# EAGLE design TSOC_GROVEY_GPIO (EAGLE 6.6.0)
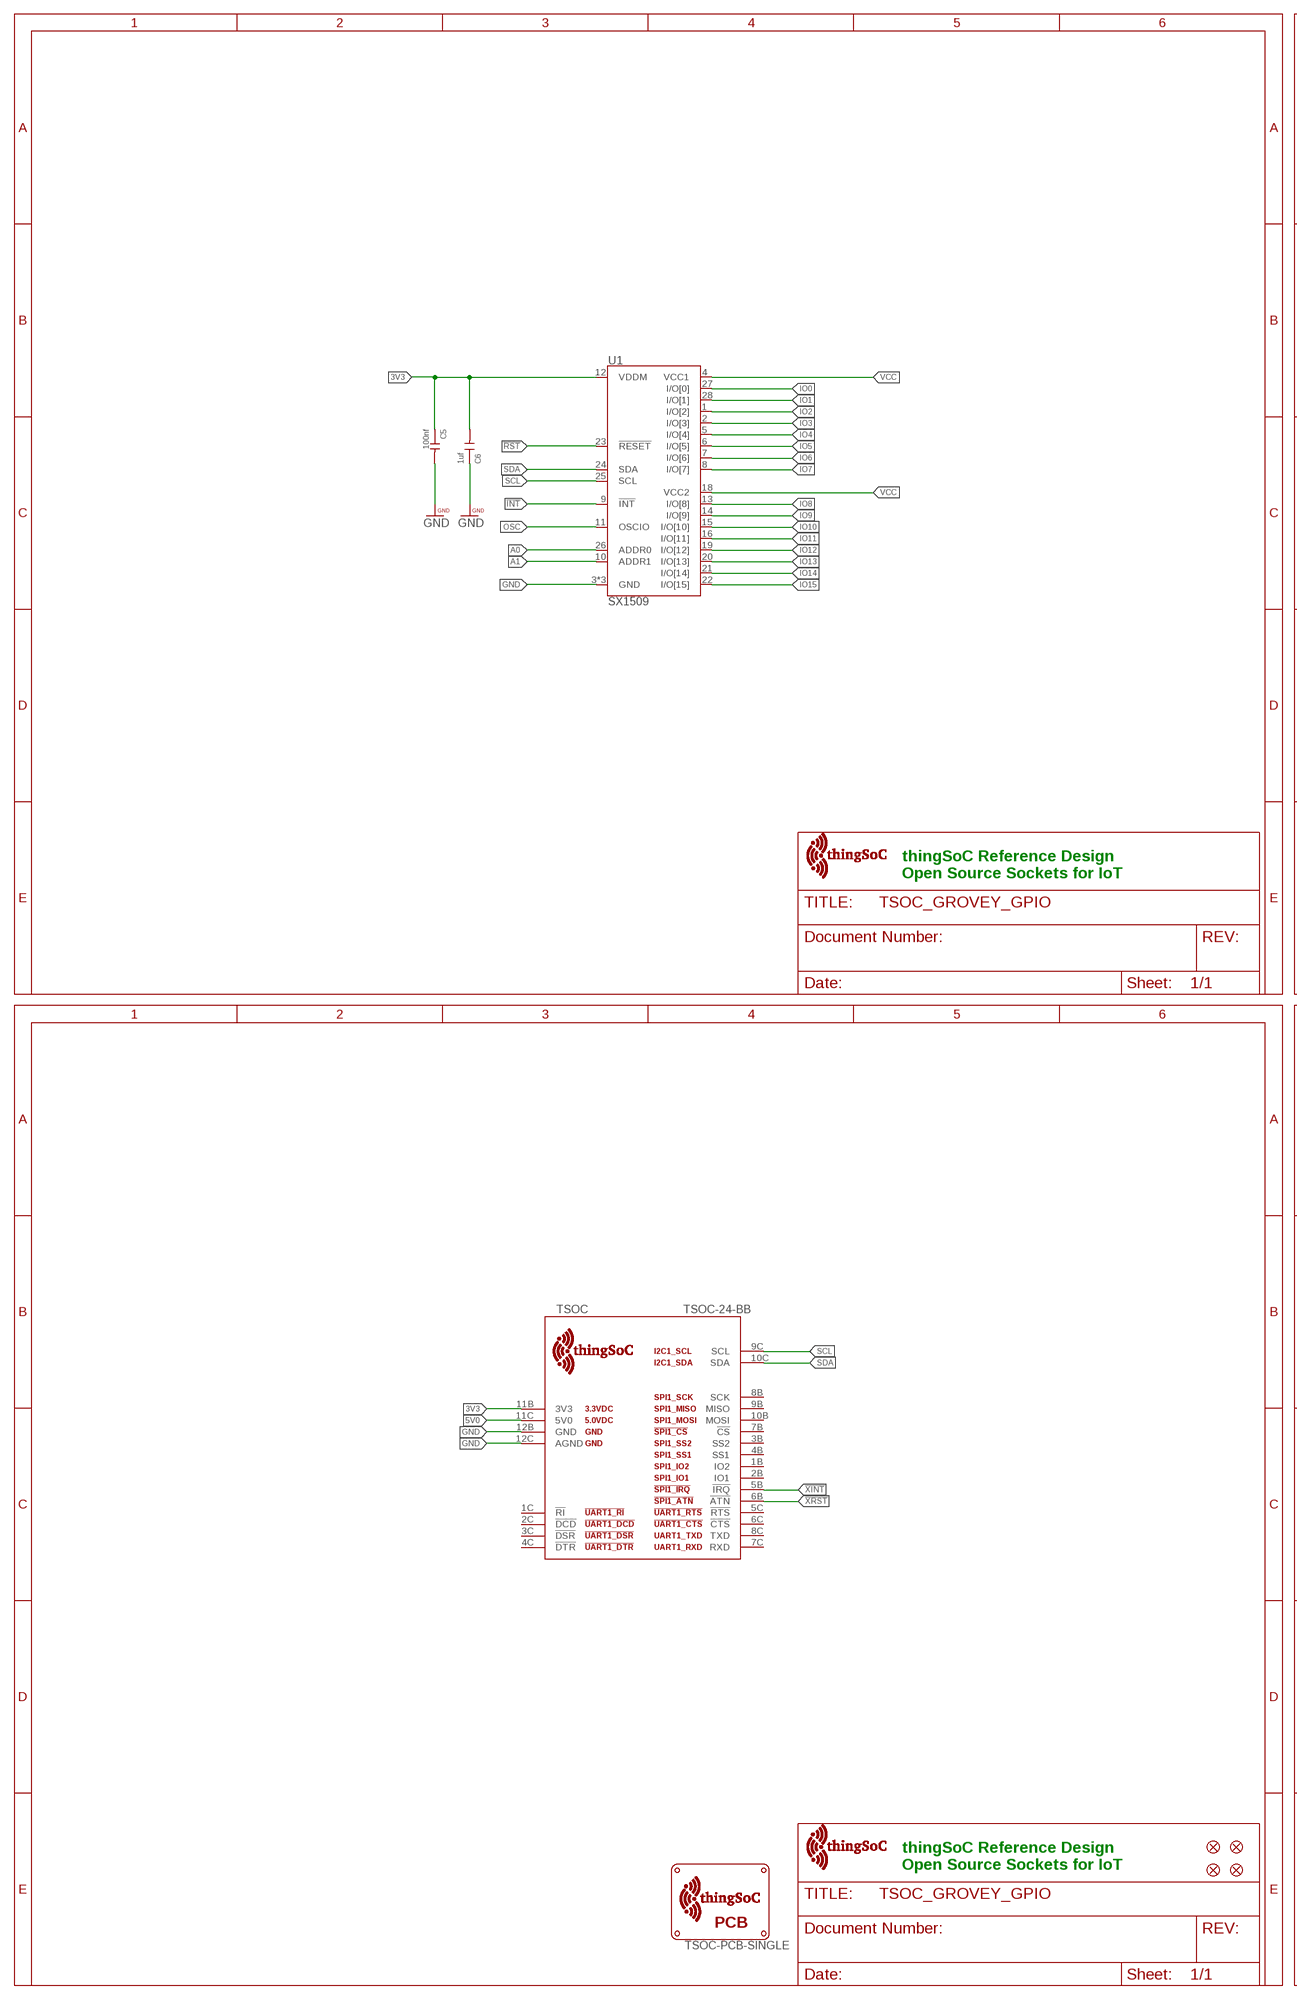
[diagram p0: schematic, sheet 1, part 1 of 2]
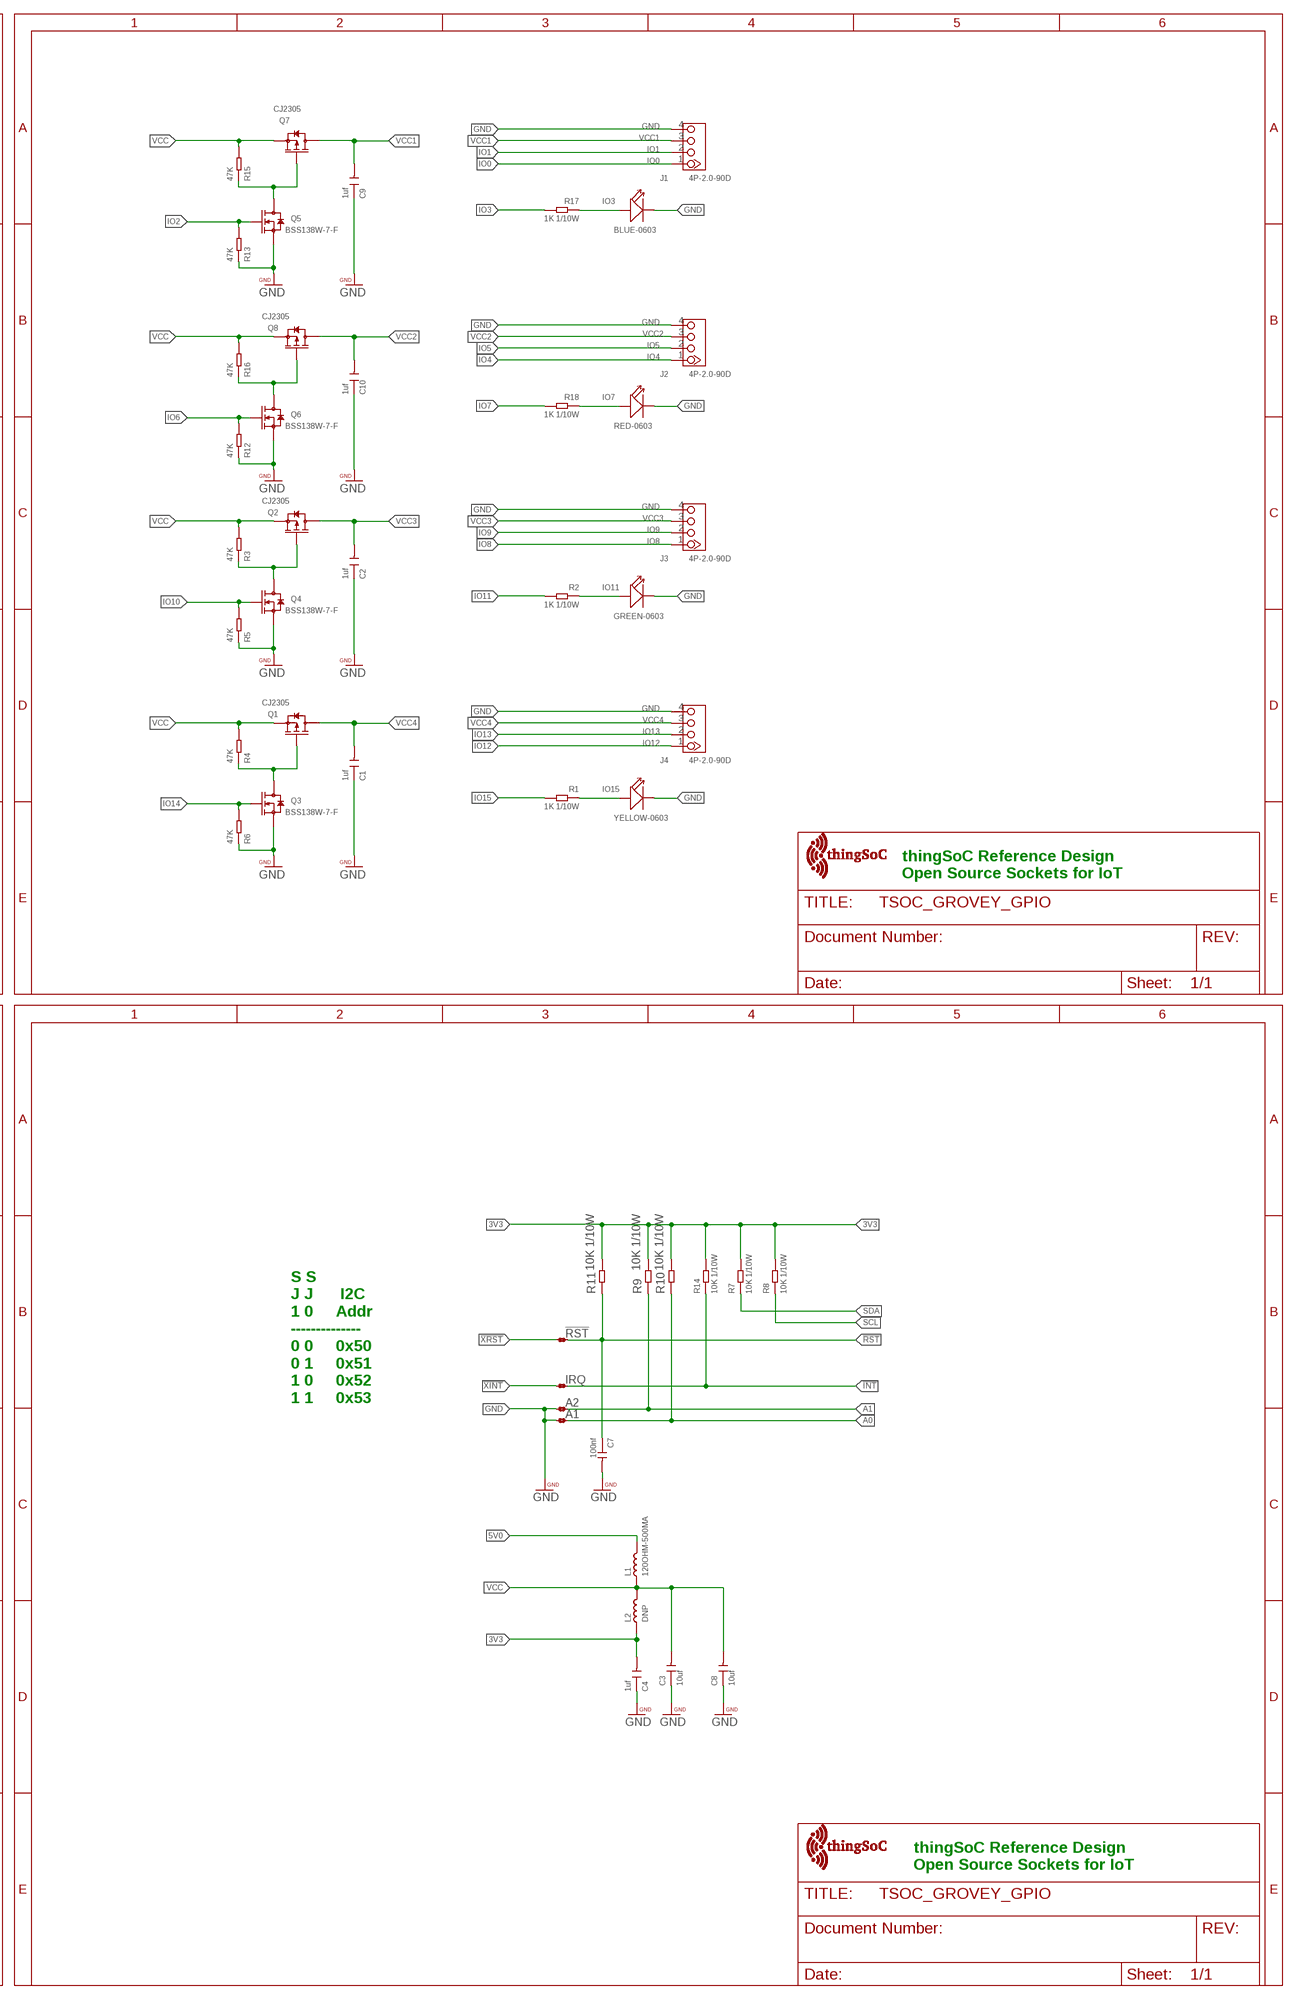
[diagram p1: schematic, sheet 1, part 2 of 2]

## Parts
!RST  NO  JMP-2-NO  [JMP-2-NO]
$$U$1  TSOC-LOGO-SMALL  [TSOC-LOGO-SML]
$$U$2  TSOC-LOGO-SMALL  [TSOC-LOGO-SML]
A1  NO  JMP-2-NO  [JMP-2-NO]
A2  NO  JMP-2-NO  [JMP-2-NO]
C1  1uf  CERAMIC-1UF-25V-10%-X7R(0603)  [C0603]
C2  1uf  CERAMIC-1UF-25V-10%-X7R(0603)  [C0603]
C3  10uf  CERAMIC-10UF-25V-10%-X5R(1206)  [C1206]
C4  1uf  CERAMIC-1UF-25V-10%-X7R(0603)  [C0603]
C5  100nf  CERAMIC-100NF-50V-10%-X7R(0603)  [C0603]
C6  1uf  CERAMIC-1UF-25V-10%-X7R(0603)  [C0603]
C7  100nf  CERAMIC-100NF-50V-10%-X7R(0603)  [C0603]
C8  10uf  CERAMIC-10UF-25V-10%-X5R(1206)  [C1206]
C9  1uf  CERAMIC-1UF-25V-10%-X7R(0603)  [C0603]
C10  1uf  CERAMIC-1UF-25V-10%-X7R(0603)  [C0603]
FID1  FIDUCIALUFIDUCIAL  [MICRO-FIDUCIAL]
FID2  FIDUCIALUFIDUCIAL  [MICRO-FIDUCIAL]
FID3  FIDUCIALUFIDUCIAL  [MICRO-FIDUCIAL]
FID4  FIDUCIALUFIDUCIAL  [MICRO-FIDUCIAL]
IO3  BLUE-0603  SMD-LED-CLEAR-BLUE(0603)  [LED-0603]
IO7  RED-0603  LED-SMD-RED-DIFFUSED(0603)  [LED-0603]
IO11  GREEN-0603  SMD-LED-CLEAR-GREEN(0603)  [LED-0603]
IO15  YELLOW-0603  SMD-LED-CLEAR-YELLOW(0603)  [LED-0603]
IRQ  NO  JMP-2-NO  [JMP-2-NO]
J1  4P-2.0-90D  GROVE-CONNECTOR-DIP-90D(4P-2.0)  [HW4-2.0-90D]
J2  4P-2.0-90D  GROVE-CONNECTOR-DIP-90D(4P-2.0)  [HW4-2.0-90D]
J3  4P-2.0-90D  GROVE-CONNECTOR-DIP-90D(4P-2.0)  [HW4-2.0-90D]
J4  4P-2.0-90D  GROVE-CONNECTOR-DIP-90D(4P-2.0)  [HW4-2.0-90D]
L1  120OHM-500MA  SMD-FERRITE-CHIP-120-OHM-500MA(0603)  [L0603]
L2  DNP  SMD-FERRITE-CHIP-120-OHM-500MA(0603)  [L0603]
Q1  CJ2305  SMD-MOSFET-P-CH-8V-4.1A-CJ2305(SOT-23)  [SOT-23]
Q2  CJ2305  SMD-MOSFET-P-CH-8V-4.1A-CJ2305(SOT-23)  [SOT-23]
Q3  BSS138W-7-F  SMD-MOSFET-N-CH-50V-200MA-BSS138W-7-F(SOT-23)  [SOT-23]
Q4  BSS138W-7-F  SMD-MOSFET-N-CH-50V-200MA-BSS138W-7-F(SOT-23)  [SOT-23]
Q5  BSS138W-7-F  SMD-MOSFET-N-CH-50V-200MA-BSS138W-7-F(SOT-23)  [SOT-23]
Q6  BSS138W-7-F  SMD-MOSFET-N-CH-50V-200MA-BSS138W-7-F(SOT-23)  [SOT-23]
Q7  CJ2305  SMD-MOSFET-P-CH-8V-4.1A-CJ2305(SOT-23)  [SOT-23]
Q8  CJ2305  SMD-MOSFET-P-CH-8V-4.1A-CJ2305(SOT-23)  [SOT-23]
R1  1K 1/10W  SMD-RES-1K-5%-1/10W(0603)  [R0603]
R2  1K 1/10W  SMD-RES-1K-5%-1/10W(0603)  [R0603]
R3  47K  SMD-RES-47K-5%-1/10W(0603)  [R0603]
R4  47K  SMD-RES-47K-5%-1/10W(0603)  [R0603]
R5  47K  SMD-RES-47K-5%-1/10W(0603)  [R0603]
R6  47K  SMD-RES-47K-5%-1/10W(0603)  [R0603]
R7  10K 1/10W  SMD-RES-10K-5%-1/10W(0603)  [R0603]
R8  10K 1/10W  SMD-RES-10K-5%-1/10W(0603)  [R0603]
R9  10K 1/10W  SMD-RES-10K-5%-1/10W(0603)  [R0603]
R10  10K 1/10W  SMD-RES-10K-5%-1/10W(0603)  [R0603]
R11  10K 1/10W  SMD-RES-10K-5%-1/10W(0603)  [R0603]
R12  47K  SMD-RES-47K-5%-1/10W(0603)  [R0603]
R13  47K  SMD-RES-47K-5%-1/10W(0603)  [R0603]
R14  10K 1/10W  SMD-RES-10K-5%-1/10W(0603)  [R0603]
R15  47K  SMD-RES-47K-5%-1/10W(0603)  [R0603]
R16  47K  SMD-RES-47K-5%-1/10W(0603)  [R0603]
R17  1K 1/10W  SMD-RES-1K-5%-1/10W(0603)  [R0603]
R18  1K 1/10W  SMD-RES-1K-5%-1/10W(0603)  [R0603]
TSOC  TSOC-24-BB  [TSOC-BB-S24]
U1  SX1509  [QFN-28]
U$3  TSOC-PCB-SINGLE  [TSOC-BB-BRD-DIM]
U$101  TSOC-LOGO-LRG  [TSOC-LOGO-LRG]
U$102  TSOC-LOGO-SMALL  [TSOC-LOGO-SML]

## Nets
3V3: C4.2 C5.1 C6.2 L2.1 R7.2 R8.2 R9.2 R10.2 R11.2 R14.2 TSOC.11B(3V3) U1.12(VDDM)
5V0: L1.2 TSOC.11C(5V0)
!INT: IRQ.2 R14.1 U1.9(!INT)
!RST: !RST.1 C7.1 R11.1 U1.23(!RESET)
!XINT: IRQ.1 TSOC.5B(!IRQ)
!XRST: !RST.2 TSOC.6B(!ATN)
A0: A1.2 R10.1 U1.26(ADDR0)
A1: A2.2 R9.1 U1.10(ADDR1)
GND: A1.1 A2.1 C1.1 C2.1 C3.1 C4.1 C5.2 C6.1 C7.2 C8.1 C9.1 C10.1 IO3.- IO7.- IO11.- IO15.- J1.4 J2.4 J3.4 J4.4 Q3.2(S) Q4.2(S) Q5.2(S) Q6.2(S) R5.1 R6.1 R12.1 R13.1 TSOC.12B(GND) TSOC.12C(AGND) U1.3(GND) U1.17(GND) U1.29(GND)
IO0: J1.1 U1.27(I/O[0])
IO1: J1.2 U1.28(I/O[1])
IO2: Q5.1(G) R13.2 U1.1(I/O[2])
IO3: R17.2 U1.2(I/O[3])
IO4: J2.1 U1.5(I/O[4])
IO5: J2.2 U1.6(I/O[5])
IO6: Q6.1(G) R12.2 U1.7(I/O[6])
IO7: R18.2 U1.8(I/O[7])
IO8: J3.1 U1.13(I/O[8])
IO9: J3.2 U1.14(I/O[9])
IO10: Q4.1(G) R5.2 U1.15(I/O[10])
IO11: R2.2 U1.16(I/O[11])
IO12: J4.1 U1.19(I/O[12])
IO13: J4.2 U1.20(I/O[13])
IO14: Q3.1(G) R6.2 U1.21(I/O[14])
IO15: R1.2 U1.22(I/O[15])
LED1: IO11.+ R2.1
LED2: IO7.+ R18.1
LED3: IO3.+ R17.1
LED4: IO15.+ R1.1
N$1: Q2.1(G) Q4.3(D) R3.1
N$2: Q1.1(G) Q3.3(D) R4.1
N$3: Q5.3(D) Q7.1(G) R15.1
N$4: Q6.3(D) Q8.1(G) R16.1
OSC: U1.11(OSCIO)
SCL: R8.1 TSOC.9C(SCL) U1.25(SCL)
SDA: R7.1 TSOC.10C(SDA) U1.24(SDA)
VCC: C3.2 C8.2 L1.1 L2.2 Q1.2(S) Q2.2(S) Q7.2(S) Q8.2(S) R3.2 R4.2 R15.2 R16.2 U1.4(VCC1) U1.18(VCC2)
VCC1: C9.2 J1.3 Q7.3(D)
VCC2: C10.2 J2.3 Q8.3(D)
VCC3: C2.2 J3.3 Q2.3(D)
VCC4: C1.2 J4.3 Q1.3(D)
Unconnected: TSOC.1B(IO2) TSOC.1C(!RI) TSOC.2B(IO1) TSOC.2C(!DCD) TSOC.3B(SS2) TSOC.3C(!DSR) TSOC.4B(SS1) TSOC.4C(!DTR) TSOC.5C(!RTS) TSOC.6C(!CTS) TSOC.7B(!CS) TSOC.7C(RXD) TSOC.8B(SCK) TSOC.8C(TXD) TSOC.9B(MISO) TSOC.10B(MOSI)

## Notes on the sheet
- thingSoC Reference Design
  Open Source Sockets for IoT
- thingSoC Reference Design
  Open Source Sockets for IoT
- S S
  J J      I2C
  1 0     Addr
  --------------
  0 0     0x50
  0 1     0x51
  1 0     0x52
  1 1     0x53
- thingSoC Reference Design
  Open Source Sockets for IoT
- thingSoC Reference Design
  Open Source Sockets for IoT

## Library data of the parts
!RST A1 A2 IRQ = scratch-ProtoPads:JMP-2-NO: Basic Jumper - Normally Open Positions 1 and 2 are normally NOT connected. PatternAgents ProtoPads Library Schematic and PCB layout libraries for design patterns by PatternAgents. For the CADSoft Eagle CAD program : http://www.cadsoftusa.com/download-eagle/ Source LBR : http://www.patternagents.com Github : https://github.com/PatternAgents License : http://creativecommons.org/licenses/by-sa/4.0/ (Creative Commons 4.0) THIS SOFTWARE IS PROVIDED BY THE CONTRIBUTORS "AS IS" AND WITHOUT ANY EXPRESS OR IMPLIED WARRANTIES, INCLUDING, BUT NOT LIMITED TO, THE IMPLIED WARRANTIES OF MERCHANTABILITY AND FITNESS FOR A PARTICULAR PURPOSE ARE DISCLAIMED. IN NO EVENT SHALL THE COPYRIGHT OWNER OR CONTRIBUTORS BE LIABLE FOR ANY DIRECT, INDIRECT, INCIDENTAL, SPECIAL, EXEMPLARY, OR CONSEQUENTIAL DAMAGES (INCLUDING, BUT NOT LIMITED TO, PROCUREMENT OF SUBSTITUTE GOODS OR SERVICES; LOSS OF USE, DATA, OR PROFITS; OR BUSINESS INTERRUPTION) HOWEVER CAUSED AND ON ANY THEORY OF LIABILITY, WHETHER IN CONTRACT, STRICT LIABILITY, OR TORT (INCLUDING NEGLIGENCE OR OTHERWISE) ARISING IN ANY WAY OUT OF THE USE OF THIS SOFTWARE, EVEN IF ADVISED OF THE POSSIBILITY OF SUCH DAMAGE.; BOM: EXCLUDE
$$U$1 $$U$2 U$101 U$102 = thingSoC:TSOC-LOGO: thingSoC Logo Source LBR : http://www.thingsoc.com Github : https://github.com/thingsoc License : http://creativecommons.org/licenses/by-sa/4.0/ (Creative Commons 4.0) THIS SOFTWARE IS PROVIDED BY THE CONTRIBUTORS "AS IS" AND WITHOUT ANY EXPRESS OR IMPLIED WARRANTIES, INCLUDING, BUT NOT LIMITED TO, THE IMPLIED WARRANTIES OF MERCHANTABILITY AND FITNESS FOR A PARTICULAR PURPOSE ARE DISCLAIMED. IN NO EVENT SHALL THE COPYRIGHT OWNER OR CONTRIBUTORS BE LIABLE FOR ANY DIRECT, INDIRECT, INCIDENTAL, SPECIAL, EXEMPLARY, OR CONSEQUENTIAL DAMAGES (INCLUDING, BUT NOT LIMITED TO, PROCUREMENT OF SUBSTITUTE GOODS OR SERVICES; LOSS OF USE, DATA, OR PROFITS; OR BUSINESS INTERRUPTION) HOWEVER CAUSED AND ON ANY THEORY OF LIABILITY, WHETHER IN CONTRACT, STRICT LIABILITY, OR TORT (INCLUDING NEGLIGENCE OR OTHERWISE) ARISING IN ANY WAY OUT OF THE USE OF THIS SOFTWARE, EVEN IF ADVISED OF THE POSSIBILITY OF SUCH DAMAGE.
C1 C2 C4 C6 C9 C10 = Seeed-Capacitor-2016:CERAMIC-1UF-25V-10%-X7R(0603): 302010139; MPN: CC0603KRX7R8BB105
C3 C8 = Seeed-Capacitor-2016:CERAMIC-10UF-25V-10%-X5R(1206): 302010181; MPN: CC1206KKX5R8BB106
C5 C7 = Seeed-Capacitor-2016:CERAMIC-100NF-50V-10%-X7R(0603): 302010138; MPN: CC0603KRX7R9BB104
FID1-FID4 = TSOC-ESP8266-BASE:FIDUCIAL: Fiducial Alignment Points Various fiducial points for machine vision alignment.
IO3 = Seeed-LED-2016:SMD-LED-CLEAR-BLUE(0603): 304090045; MPN: 19-217-BHC-ZL1M2RY-3T
IO7 = Seeed-LED-2016:LED-SMD-RED-DIFFUSED(0603): 304090042; MPN: 19-217-R6C-AL1M2VY-3T
IO11 = Seeed-LED-2016:SMD-LED-CLEAR-GREEN(0603): 304090043; MPN: 19-217-G7C-AN1P2-3T
IO15 = Seeed-LED-2016:SMD-LED-CLEAR-YELLOW(0603): 304090044; MPN: 19-217-Y5C-AM1N1VY-3T
J1-J4 = Seeed-Connector -2016:GROVE-CONNECTOR-DIP-90D(4P-2.0): 320110034
L1 = Seeed-Inductor-2016:SMD-FERRITE-CHIP-120-OHM-500MA(0603): 303030001; MPN: BLM18AG121SN1D
L2 = Seeed-Inductor-2016:SMD-FERRITE-CHIP-120-OHM-500MA(0603): 303030001; MPN: BLM18AG121SN1D; VALUE: 120OHM-500MA
Q1 Q2 Q7 Q8 = Seeed-Transistor-2016:SMD-MOSFET-P-CH-8V-4.1A-CJ2305(SOT-23): 305030014; MPN: CJ2305
Q3-Q6 = Seeed-Transistor-2016:SMD-MOSFET-N-CH-50V-200MA-BSS138W-7-F(SOT-23): 305030000; MPN: BSS138W-7-F
R1 R2 R17 R18 = Seeed-Resistor-2016:SMD-RES-1K-5%-1/10W(0603): 301010291; MPN: RC0603JR-071KL
R3-R6 R12 R13 R15 R16 = Seeed-Resistor-2016:SMD-RES-47K-5%-1/10W(0603): 301010084; MPN: RC0603JR-0747KL
R7-R11 R14 = Seeed-Resistor-2016:SMD-RES-10K-5%-1/10W(0603): 301010293; MPN: RC0603JR-0710KL
TSOC = thingSoC:TSOC-24: thingSoC Twenty-Four(24) Pin Socket Source LBR : http://www.thingsoc.com Github : https://github.com/thingsoc License : http://creativecommons.org/licenses/by-sa/4.0/ (Creative Commons 4.0) THIS SOFTWARE IS PROVIDED BY THE CONTRIBUTORS "AS IS" AND WITHOUT ANY EXPRESS OR IMPLIED WARRANTIES, INCLUDING, BUT NOT LIMITED TO, THE IMPLIED WARRANTIES OF MERCHANTABILITY AND FITNESS FOR A PARTICULAR PURPOSE ARE DISCLAIMED. IN NO EVENT SHALL THE COPYRIGHT OWNER OR CONTRIBUTORS BE LIABLE FOR ANY DIRECT, INDIRECT, INCIDENTAL, SPECIAL, EXEMPLARY, OR CONSEQUENTIAL DAMAGES (INCLUDING, BUT NOT LIMITED TO, PROCUREMENT OF SUBSTITUTE GOODS OR SERVICES; LOSS OF USE, DATA, OR PROFITS; OR BUSINESS INTERRUPTION) HOWEVER CAUSED AND ON ANY THEORY OF LIABILITY, WHETHER IN CONTRACT, STRICT LIABILITY, OR TORT (INCLUDING NEGLIGENCE OR OTHERWISE) ARISING IN ANY WAY OUT OF THE USE OF THIS SOFTWARE, EVEN IF ADVISED OF THE POSSIBILITY OF SUCH DAMAGE.
U1 = SparkFun-DigitalIC:SX1509: Semtech SX1509 The SX1509 is a complete ultra low voltage 1.2V to 3.6V General Purpose parallel Input/Output (GPIO) expanders ideal for low power handheld battery powered equipment. This version comes in a 16-channel configuration and allows easy serial expansion of I/O through a standard 400kHz I2C interface. GPIO devices can provide additional control and monitoring when the microcontroller or chipset has insufficient I/O ports, or in systems where serial communication and control from a remote location is advantageous.; PROD_ID: IC-11311
U$3 = thingSoC:TSOC-PCB: thingSoC PCB Outlines Boards Outlines for Standard Sizes (in the DImension Layer) (Registration marks in the tDocu layer - make sure to turn on tDocu/bDocu) Source LBR : http://www.thingsoc.com Github : https://github.com/thingsoc License : http://creativecommons.org/licenses/by-sa/4.0/ (Creative Commons 4.0) THIS SOFTWARE IS PROVIDED BY THE CONTRIBUTORS "AS IS" AND WITHOUT ANY EXPRESS OR IMPLIED WARRANTIES, INCLUDING, BUT NOT LIMITED TO, THE IMPLIED WARRANTIES OF MERCHANTABILITY AND FITNESS FOR A PARTICULAR PURPOSE ARE DISCLAIMED. IN NO EVENT SHALL THE COPYRIGHT OWNER OR CONTRIBUTORS BE LIABLE FOR ANY DIRECT, INDIRECT, INCIDENTAL, SPECIAL, EXEMPLARY, OR CONSEQUENTIAL DAMAGES (INCLUDING, BUT NOT LIMITED TO, PROCUREMENT OF SUBSTITUTE GOODS OR SERVICES; LOSS OF USE, DATA, OR PROFITS; OR BUSINESS INTERRUPTION) HOWEVER CAUSED AND ON ANY THEORY OF LIABILITY, WHETHER IN CONTRACT, STRICT LIABILITY, OR TORT (INCLUDING NEGLIGENCE OR OTHERWISE) ARISING IN ANY WAY OUT OF THE USE OF THIS SOFTWARE, EVEN IF ADVISED OF THE POSSIBILITY OF SUCH DAMAGE.

## Board
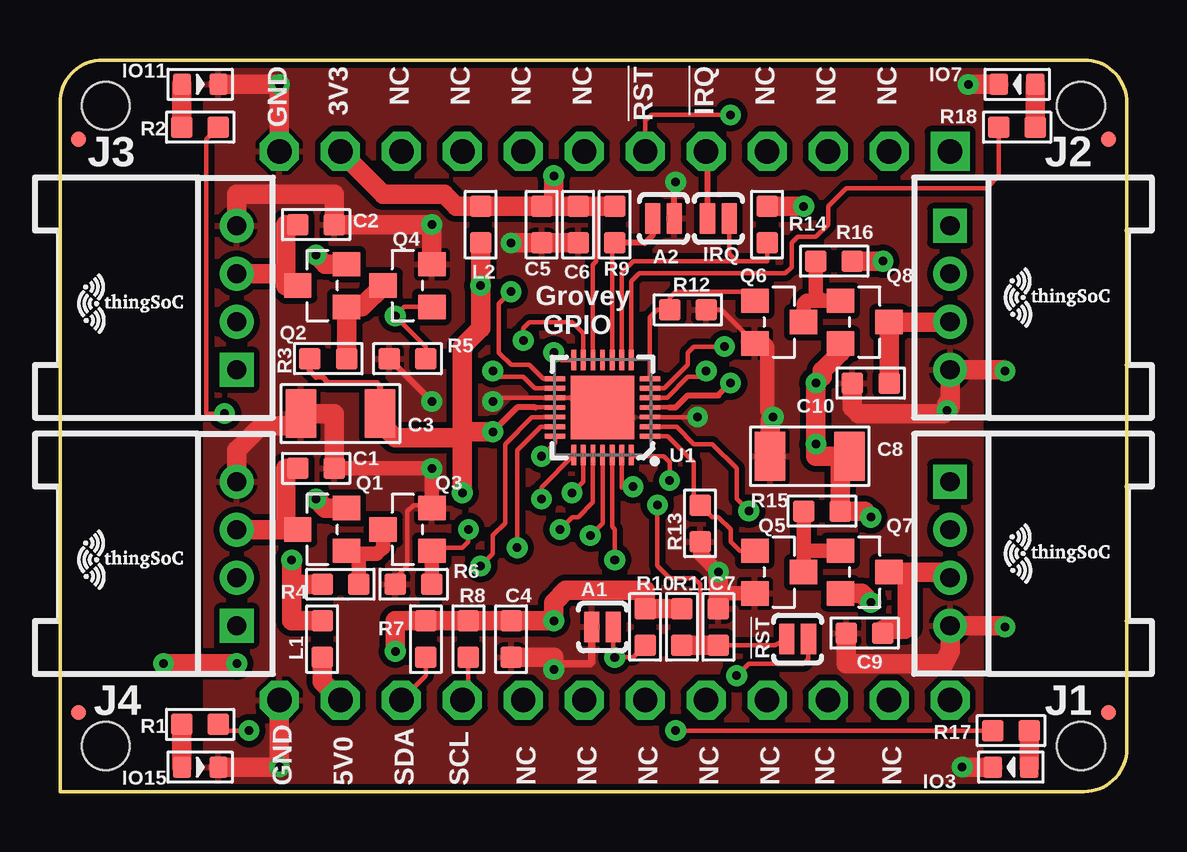
[diagram p2: board, top side]
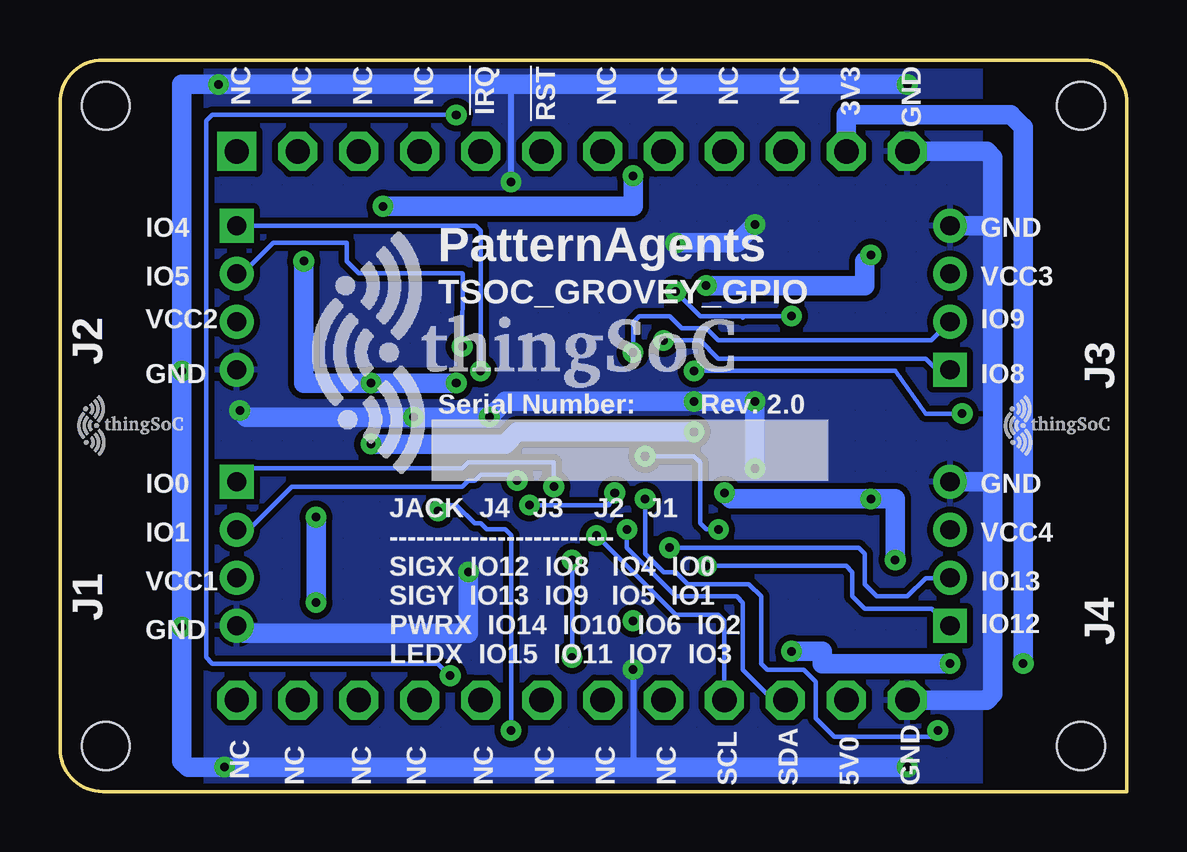
[diagram p3: board, bottom side, seen from below]

Size 44.45 x 30.48 mm. Coordinates in mm from the lower left corner, seen from the top.
Copper layers (1*16): Top 0.035mm / dielectric 1.5mm / Bottom 0.035mm
Design rules "PatternAgents_7mil": minimum track width 7mil, minimum drill 14mil, track to track 7mil, track to pad 7mil, pad to pad 7mil, via to via 7mil, smd to smd 7mil, copper to edge 7mil, drill to drill 7mil, minimum pad ring 12mil, minimum via ring 10mil, stop-mask expansion 4mil, vias tented up to drill 25mil, thermal gap 7mil

### Footprints (pad centres in the part's own frame; a part is rotated, then mirrored left to right if it is on the bottom)
JMP-2-NO = smd 0.635 x 1.27: 1 -0.45,0; 2 0.45,0
C0603 = smd 0.889 x 0.889: 1 0,0.762; 2 0,-0.762
C1206 = smd 1.27 x 2.032: 1 -1.651,0; 2 1.651,0
MICRO-FIDUCIAL = smd 0.635 x 0.635: 1 0,0
LED-0603 = smd 0.762 x 0.889: + -0.762,0; - 0.762,0
HW4-2.0-90D = drill 0.8 pad 1.27 square: 1 -3,0 | drill 0.8 pad 1.27: 2 -1,0; 3 1,0; 4 3,0
L0603 = smd 0.889 x 0.889: 1 -0.762,0; 2 0.762,0
SOT-23 = smd 1.016 x 1.143: 1 -0.889,-1.016; 2 0.889,-1.016; 3 0,1.016
R0603 = smd 0.889 x 0.889: 1 0,0.762; 2 0,-0.762
TSOC-BB-S24 = drill 1.016 square: 1B -11.43,11.43 | drill 1.016 octagon: 1C 11.43,11.43; 2B -11.43,8.89; 2C 11.43,8.89; 3B -11.43,6.35; 3C 11.43,6.35; 4B -11.43,3.81; 4C 11.43,3.81; 5B -11.43,1.27; 5C 11.43,1.27; 6B -11.43,-1.27; 6C 11.43,-1.27; 7B -11.43,-3.81; 7C 11.43,-3.81; 8B -11.43,-6.35; 8C 11.43,-6.35; 9B -11.43,-8.89; 9C 11.43,-8.89; 10B -11.43,-11.43; 10C 11.43,-11.43; 11B -11.43,-13.97; 11C 11.43,-13.97; 12B -11.43,-16.51; 12C 11.43,-16.51
QFN-28 = smd 0.85 x 0.2: 1 -1.975,1.2; 2 -1.975,0.8; 3 -1.975,0.4; 4 -1.975,0; 5 -1.975,-0.4; 6 -1.975,-0.8; 7 -1.975,-1.2; 15 1.975,-1.2; 16 1.975,-0.8; 17 1.975,-0.4; 18 1.975,0; 19 1.975,0.4; 20 1.975,0.8; 21 1.975,1.2 | smd 0.2 x 0.85: 8 -1.2,-1.975; 9 -0.8,-1.975; 10 -0.4,-1.975; 11 0,-1.975; 12 0.4,-1.975; 13 0.8,-1.975; 14 1.2,-1.975; 22 1.2,1.975; 23 0.8,1.975; 24 0.4,1.975; 25 0,1.975; 26 -0.4,1.975; 27 -0.8,1.975; 28 -1.2,1.975 | smd 2.65 x 2.65: 29 0,0
TSOC-BB-BRD-DIM = hole 2: 13.335,16.891; -13.335,16.891; 13.335,-23.749; -13.335,-23.749

### Placement (x,y rotation side)
!RST  30.73,6.35 0 top
$$U$1  40.13,9.91 0 top
$$U$2  40.13,20.57 0 top
A1  22.61,6.86 0 top
A2  25.15,23.88 180 top
C1  10.67,13.46 270 top
C2  10.67,23.62 270 top
C3  11.68,15.75 0 top
C4  18.8,6.35 180 top
C5  20.07,23.62 0 top
C6  21.59,23.62 180 top
C7  27.43,6.86 180 top
C8  31.24,13.97 0 top
C9  33.53,6.6 90 top
C10  33.78,17.02 90 top
FID1  0.76,3.3 0 top
FID2  0.76,27.18 0 top
FID3  43.69,3.3 0 top
FID4  43.69,27.18 0 top
IO3  39.62,1.02 180 top
IO7  39.88,29.46 180 top
IO11  5.84,29.46 0 top
IO15  5.84,1.02 0 top
IRQ  27.43,23.88 0 top
J1  37.08,9.91 270 top
J2  37.08,20.57 270 top
J3  7.37,20.57 90 top
J4  7.37,9.91 90 top
L1  10.92,6.35 270 top
L2  17.53,23.62 270 top
Q1  10.92,10.92 90 top
Q2  10.92,21.08 90 top
Q3  14.48,10.92 90 top
Q4  14.48,21.08 90 top
Q5  29.97,9.14 270 top
Q6  29.97,19.56 270 top
Q7  33.53,9.14 270 top
Q8  33.53,19.56 270 top
R1  5.84,2.79 90 top
R2  5.84,27.69 90 top
R3  11.18,18.03 270 top
R4  11.68,8.64 270 top
R5  14.48,18.03 90 top
R6  14.73,8.64 90 top
R7  15.24,6.35 180 top
R8  17.02,6.35 180 top
R9  23.11,23.62 180 top
R10  24.38,6.86 180 top
R11  25.91,6.86 180 top
R12  26.16,20.07 270 top
R13  26.67,11.18 180 top
R14  29.46,23.62 180 top
R15  31.75,11.68 90 top
R16  32.26,22.1 90 top
R17  39.62,2.54 270 top
R18  39.88,27.69 270 top
TSOC  25.65,15.24 270 top
U1  22.61,16 180 top
U$1  TSOC-LOGO-SMALL  [TSOC-LOGO-SML]  1.52,9.65 0 top
U$2  TSOC-LOGO-SMALL  [TSOC-LOGO-SML]  1.52,20.32 0 top
U$3  25.65,15.24 270 top
U$100  TSOC-LOGO-SMALL  [TSOC-LOGO-SML]  4.32,15.24 0 bottom
U$101  30.73,18.29 0 bottom
U$102  42.93,15.24 0 bottom

### Tracks (layer width: path | path; a pad name or v marks a point on that pad's centre or on a via)
3V3  (via drill 0.36)
  Top 0.178: 22.21,24.28 22.35,24.28 | 22.35,24.28 23.01,24.28 R9.2 | U1.12 22.21,21.95 22.35,22.1 22.35,24.28
  Top 0.813: R11.2 R10.2 24.38,8.38 21.08,8.38 20.57,7.87 v20.57,7.11 C4.2 R8.2 R7.2 13.97,7.11 v13.97,5.84 | R14.2 v30.99,24.38 | TSOC.11B 13.46,24.89 16,24.89 16.51,24.38 L2.1 C5.1 20.57,24.38 | v20.57,25.65 20.57,24.38 | 20.57,24.38 C6.2 R9.2 | v4.32,5.33 v7.37,5.33
  Bottom 0.813: TSOC.11B 11.68,28.19 4.83,28.19 4.32,27.69 v4.32,5.33 | v30.99,24.38 20.57,24.38 v20.57,25.65 | v13.97,5.84 12.7,5.84 12.7,5.33 v7.37,5.33
5V0
  Top 0.813: TSOC.11C 10.92,4.57 L1.2
!INT
  Top 0.178: U1.9 23.41,21.63 23.88,22.1 28.19,22.1 | 28.19,22.1 29.46,22.1 R14.1 | IRQ.2 27.88,22.41 28.19,22.1
!RST  (via drill 0.36)
  Top 0.178: U1.23 21.81,12.92 v21.34,12.45 | R11.1 26.42,6.1 26.67,6.35 26.67,8.64 26.42,8.89 25.4,8.89 24.89,9.4 v24.89,11.94 | C7.1 29.78,6.1 !RST.1
  Top 0.813: C7.1 R11.1
  Bottom 0.178: v21.34,12.45 21.59,11.94 v24.89,11.94
!XINT
  Top 0.254: IRQ.1 26.98,26.61 TSOC.5B
!XRST  (via drill 0.36)
  Top 0.178: !RST.2 31.18,5.53 30.99,5.33 28.7,5.33 v28.19,4.83 | v27.94,28.19 24.64,28.19 24.38,27.94 TSOC.6B
  Bottom 0.178: v28.19,4.83 28.7,5.33 38.1,5.33 38.35,5.59 38.35,27.94 38.1,28.19 v27.94,28.19
A0  (via drill 0.36)
  Top 0.178: U1.26 23.01,11.03 23.11,10.92 v23.11,9.65 | 23.11,7.05 A1.2 23.06,5.65 v23.11,5.59 23.88,5.59 R10.1
  Bottom 0.178: v23.11,5.59 v23.11,9.65
A1
  Top 0.178: U1.10 23.01,22.75 R9.1
  Top 0.254: A2.2 24.7,23.17 24.38,22.86 R9.1
GND  (via drill 0.36)
  Top 0.178: 23.01,15.6 U1.29 | 22.61,15.6 22.61,15.75 | 22.61,15.75 U1.29 | 22.75,15.6 22.61,15.75 | v18.03,16.26 18.18,16.4 U1.17 22.21,16.4 22.23,16.36 22.58,16 U1.29 | U1.3 v26.56,15.6 | U1.29 23.11,16 23.62,15.49 | R12.1 27.56,20.07 Q6.2 | R6.1 13.97,8.89 14.48,9.4 14.48,11.68 14.73,11.94 15.37,11.94 Q3.2
  Top 0.254: A2.1 25.6,25.34 v25.65,25.4 | R5.1 v15.49,16.26
  Top 0.305: A1.1 22.16,5.39 22.1,5.33 20.83,5.33 v20.57,5.08
  Top 0.61: R13.1 26.67,9.91 v27.43,9.14 | Q5.2 27.56,8.26 27.43,8.13 | Q6.2 29.34,18.67 29.46,18.54 29.46,15.86 v29.72,15.6 | C1.1 v15.49,13.46 Q3.2
  Top 0.813: IO7.- v37.85,29.46 | IO11.- v9.14,29.46 TSOC.12B | IO15.- v9.14,1.02 TSOC.12C | J3.4 7.37,24.89 11.43,24.89 C2.1 v15.49,23.62 Q4.2 | v18.8,22.86 C5.2 C6.1 | C7.2 27.43,8.13 v27.43,9.14 | v39.37,17.53 39.32,17.57 J2.4 37.08,16.26 | v39.37,6.86 39.32,6.91 J1.4 37.08,5.84 36.83,5.33 32.77,5.33 C9.1 | C10.1 33.02,16 33.27,15.75 36.83,15.75 v36.96,15.88 | v36.96,15.88 37.08,16 37.08,16.26 | v36.96,15.88 36.96,16.13 37.08,16.26 | IO3.- v37.59,1.02 | C8.1 29.59,15.47 v29.72,15.6 | C4.1 20.57,5.59 v20.57,5.08 | C1.1 11.43,15.75 C3.1 9.78,15.24 8.38,15.24 7.37,14.22 J4.4
  Bottom 0.254: v20.57,5.08 20.57,1.02 | 25.91,29.46 28.45,29.46 | v25.65,25.4 25.65,29.46
  Bottom 0.813: v9.14,29.46 25.65,29.46 25.91,29.46 v37.85,29.46 | v9.14,1.02 20.57,1.02 v37.59,1.02 39.12,1.02 39.37,1.27 v39.37,6.86 v39.37,17.53 39.37,29.46 v37.85,29.46 | 5.59,12.95 5.59,23.37 | 5.59,23.37 5.59,26.42 5.84,26.67 TSOC.12B | J3.4 5.79,23.57 5.59,23.37 | J4.4 5.64,12.91 5.59,12.95 | v37.85,29.46 36.58,29.46 | v18.03,16.26 v15.49,16.26 v15.49,13.46 | v18.8,22.86 16.26,22.86 v15.49,23.62 | v27.43,9.14 27.43,6.6 36.78,6.6 J1.4 37.04,6.86 | 5.59,12.95 5.59,4.06 5.84,3.81 TSOC.12C | v36.96,15.88 36.68,15.6 v29.72,15.6 v26.56,15.6 25.91,16.26 18.29,16.26
  pour Top (isolate 0.254, rank 2, hatched): 6.1,0 6.1,30.48 38.35,30.48 38.35,0
  pour Bottom (isolate 0.254, rank 2, hatched): 6.1,0 6.1,30.48 38.35,30.48 38.35,0
IO0  (via drill 0.36)
  Top 0.178: 23.62,12.7 v23.88,12.7 23.41,12.66 U1.27
  Bottom 0.178: J1.1 37.08,13.21 36.83,13.46 27.69,13.46 27.43,13.72 23.88,13.72 v23.88,12.7
IO1  (via drill 0.36)
  Top 0.178: v25.4,12.95 25.4,13.72 25.15,13.97 23.86,13.97 U1.28
  Bottom 0.178: J1.2 36.59,10.91 34.8,12.7 27.69,12.7 27.43,12.95 27.18,12.95 26.92,13.21 25.65,13.21 v25.4,12.95
IO2
  Top 0.178: U1.1 25.33,14.8 26.42,13.72 26.42,12.19 R13.2 27.18,11.43 27.43,11.43 27.94,10.92 27.94,10.41 28.32,10.03 Q5.1
IO3  (via drill 0.36)
  Top 0.178: R17.2 v25.65,2.54 | v28.7,11.68 28.19,12.19 28.19,13.46 27.18,14.48 26.42,14.48 25.69,15.2 U1.2
  Bottom 0.178: v25.65,2.54 25.65,10.67 25.91,10.92 26.67,10.92 26.92,11.18 27.18,11.18 27.94,11.94 28.45,11.94 v28.7,11.68
IO4  (via drill 0.36)
  Top 0.178: v26.92,17.53 26.67,17.27 26.16,17.27 25.29,16.4 U1.5
  Bottom 0.178: J2.1 27.13,23.57 26.92,23.37 v26.92,17.53
IO5  (via drill 0.36)
  Top 0.178: U1.6 25.18,16.8 26.16,17.78 26.16,18.29 26.42,18.54 v27.69,18.54
  Bottom 0.178: v27.69,18.54 27.67,21.57 27.69,21.59 32,21.59 32.51,22.1 32.51,22.86 35.56,22.86 36.85,21.57 J2.2
IO6
  Top 0.178: U1.7 24.58,19.75 24.89,20.07 R12.2 25.4,20.57 25.65,20.83 28.57,20.83 Q6.1
IO7
  Top 0.178: R18.2 39.12,25.65 38.61,25.15 32.77,25.15 32,24.38 32,23.62 31.5,23.11 30.73,23.11 30.48,22.86 30.48,21.84 30.23,21.59 24.13,21.59 23.81,21.27 U1.8
IO8  (via drill 0.36)
  Top 0.178: U1.13 21.81,19.09 21.34,19.56 19.56,19.56 19.3,19.3 v19.3,18.8
  Bottom 0.178: J3.1 7.92,17.57 8.38,18.03 17.02,18.03 17.78,18.8 v19.3,18.8
IO9  (via drill 0.36)
  Top 0.178: U1.14 20.89,17.98 v20.57,18.29
  Bottom 0.178: v20.57,18.29 20.57,19.56 20.32,19.81 19.05,19.81 18.54,19.3 17.53,19.3 17.02,18.8 8.14,18.8 J3.2
IO10  (via drill 0.36)
  Top 0.178: U1.15 20.14,17.2 19.56,17.78 18.8,17.78 18.29,18.29 18.29,20.32 v18.8,20.83 | R5.2 15.24,18.54 v13.97,19.81 14.35,20.19 Q4.1
  Bottom 0.178: v13.97,19.81 16,19.81 | 16,19.81 17.78,19.81 v18.8,20.83 | 16,19.74 16,19.81
IO11  (via drill 0.36)
  Top 0.178: v6.86,15.75 6.1,15.75 6.1,27.18 R2.2 | U1.16 19.77,16.8 19.3,17.27 18.29,17.27 v18.03,17.53
  Bottom 0.178: v18.03,17.53 9.65,17.53 8.38,15.75 v6.86,15.75
IO12  (via drill 0.36)
  Top 0.178: U1.19 19.67,15.6 18.54,14.48 18.54,11.18 18.03,10.67 18.03,9.91 v17.53,9.4
  Bottom 0.178: v17.53,9.4 11.68,9.4 11.43,9.14 11.43,8.13 10.92,7.62 8.13,7.62 7.46,6.95 | 7.41,6.86 7.41,6.91 7.46,6.95 | J4.1 7.47,6.93 7.46,6.95
IO13  (via drill 0.36)
  Top 0.178: v19.05,10.16 19.05,14.22 20.03,15.2 U1.20
  Bottom 0.178: v19.05,10.16 11.18,10.16 10.92,9.91 10.92,8.64 10.41,8.13 9.14,8.13 8.38,8.89 7.38,8.89 J4.2
IO14  (via drill 0.36)
  Top 0.178: U1.21 20.63,14.54 v20.07,13.97 | v17.02,10.92 17.02,10.41 16.76,10.16 15.62,10.16 Q3.1
  Top 0.61: R6.2 Q3.1
  Bottom 0.178: v20.07,13.97 18.03,13.97 17.78,13.72 17.78,11.18 17.53,10.92 v17.02,10.92
IO15  (via drill 0.36)
  Top 0.178: v20.07,12.19 20.07,12.69 U1.22 | v7.87,2.54 6.86,2.54 R1.2
  Bottom 0.178: v20.07,12.19 20.07,9.91 19.3,9.14 18.8,9.14 18.29,8.64 15.75,8.64 15.24,8.13 15.24,5.33 14.99,5.08 13.46,5.08 12.95,4.57 12.95,3.05 12.19,2.29 8.13,2.29 v7.87,2.54
LED1
  Top 0.813: IO11.+ R2.1
LED2
  Top 0.813: IO7.+ R18.1
LED3
  Top 0.813: R17.1 IO3.+
LED4
  Top 0.813: IO15.+ R1.1
N$1
  Top 0.813: R3.1 Q2.1 12.57,20.19 Q4.3
N$2
  Top 0.178: 12.03,10.07 12.09,10.13 Q1.1
  Top 0.254: 12.06,10.03 12.03,10.07 11.94,10.16
  Top 0.61: Q3.3 13.46,10.16 13.21,9.91 12.45,9.91 | 12.45,9.91 12.06,9.91 Q1.1 | R4.1 12.45,9.91
N$3
  Top 0.61: Q5.3 30.99,9.91 | 30.99,9.91 R15.1 | Q7.1 31.11,10.03 30.99,9.91
N$4
  Top 0.61: Q8.1 31.75,20.45 | 31.75,20.45 31.11,20.45 30.99,20.32 Q6.3 | R16.1 31.5,20.7 31.75,20.45
SCL  (via drill 0.36)
  Top 0.178: U1.25 22.61,11.18 v22.1,10.67 | R8.1 17.02,4.06 TSOC.9C
  Bottom 0.178: v22.1,10.67 18.8,7.37 17.02,7.37 16.76,7.11 TSOC.9C
SDA  (via drill 0.36)
  Top 0.178: U1.24 22.21,12.05 21.59,11.43 21.34,11.43 v20.83,10.92 | R7.1 15.24,4.83 TSOC.10C
  Bottom 0.178: v20.83,10.92 20.83,10.16 18.8,8.13 16.26,8.13 16,7.87 16,5.08 14.73,3.81 TSOC.10C
VCC  (via drill 0.36)
  Top 0.178: U1.18 19.81,16 | U1.4 25.4,16
  Top 0.254: 19.81,16 19.05,16 v18.03,14.99 | 25.4,16 25.65,16 26.16,16.51 27.43,16.51 v27.94,17.02 | C3.2 13.34,16.89 13.21,17.02 11.18,17.02 10.92,17.27 10.67,17.27 10.41,17.53 R3.2
  Top 0.61: C3.2 13.34,15.37
  Top 0.813: Q1.2 11.05,11.81 v10.67,12.19 | Q2.2 11.05,21.97 v10.67,22.35 | v16.76,12.45 16.76,14.73 | 16.76,14.73 16.76,15.24 | L2.2 v17.53,21.08 17.53,19.3 16.76,18.54 16.76,15.24 | v9.65,9.65 9.65,8.64 | R4.2 9.65,8.64 | Q7.2 33.4,8.26 v33.78,7.87 | v33.78,11.43 33.53,11.68 R15.2 32.51,13.59 C8.2 31.5,13.97 v31.5,14.48 v31.5,17.02 31.75,17.27 31.75,17.53 32.51,18.29 Q8.2 | 16.76,15.24 17.02,14.99 v18.03,14.99 | R16.2 v34.29,22.1 | L1.1 9.65,7.11 9.65,8.64 | 13.34,15.37 13.97,14.73 16.76,14.73
  Bottom 0.813: v10.67,22.35 10.92,22.1 10.92,21.08 v17.53,21.08 | v9.65,9.65 9.65,12.19 v10.67,12.19 16.51,12.19 v16.76,12.45 | v33.78,7.87 v33.78,11.43 | v27.94,17.02 v31.5,17.02 34.29,17.02 v34.29,22.1 | v18.03,14.99 25.4,14.99 25.91,14.48 v31.5,14.48
VCC1
  Top 0.178: 34.31,6.76 C9.2 | 36.45,8.89 J1.3 36.98,9.07 36.85,9.14
  Top 0.813: Q7.3 35.31,9.14 | 35.31,9.14 36.85,9.14 | 34.31,6.76 35.2,6.76 35.31,6.86 35.31,9.14
VCC2
  Top 0.178: 36.98,19.56 J2.3
  Top 0.813: C10.2 Q8.3 36.98,19.56 37.07,19.56
VCC3
  Top 0.813: C2.2 9.4,23.62 9.4,21.59 | 9.4,21.59 9.4,21.08 Q2.3 | J3.3 9.38,21.57 9.4,21.59
VCC4
  Top 0.813: 9.4,10.91 9.89,10.91 Q1.3 | C1.2 9.4,13.46 9.4,10.91 | J4.3 9.4,10.91

### Text on the board
tPlace: GND | 3V3 | NC | NC | NC | NC | !RST | !IRQ | NC | NC | NC | Grovey / GPIO | GND | 5V0 | SDA | SCL | NC | NC | NC | NC | NC | NC | NC
bPlace: GND | 3V3 | NC | NC | NC | NC | !RST | !IRQ | NC | NC | NC | NC | GND | IO4 | PatternAgents | VCC3 | IO5 | TSOC_GROVEY_GPIO | IO9 | VCC2 | J2 | J3 | IO8 | GND | Rev. 2.0 | Serial Number: | GND | IO0 | VCC4 | IO1 | IO13 | VCC1 | IO12 | J1 | J4 | GND | JACK J4 J3 J2 J1 / ------------------------- / SIGX IO12 IO8 IO4 IO0 / SIGY IO13 IO9 IO5 IO1 / PWRX IO14 IO10 IO6 IO2 / LEDX IO15 IO11 IO7 IO3 | NC | GND | 5V0 | SDA | SCL | NC | NC | NC | NC | NC | NC | NC